# Altium schematic sheet I2Cbus.SchDoc
size A4
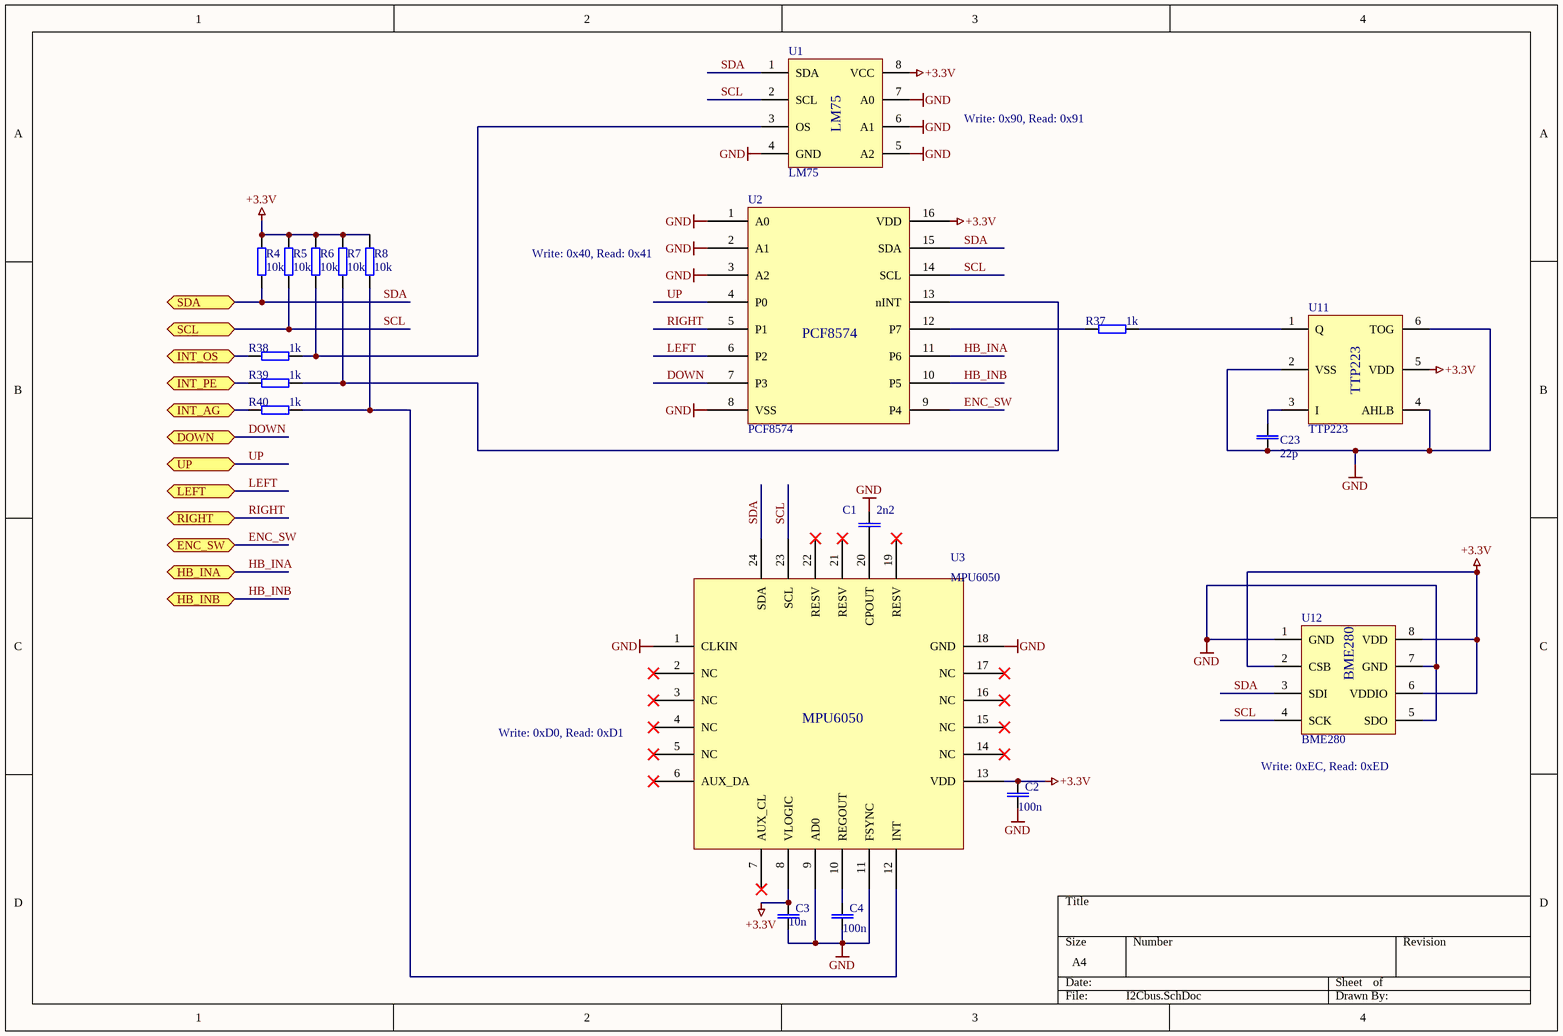
[diagram p0: I2Cbus.SchDoc]

## Parts
C1  2n2  [CAP 0805]
C2  100n  [CAP 0805]
C3  10n  [CAP 0805]
C4  100n  [CAP 0805]
C23  22p  [CAP 0805]
R4  10k  [RES 0805]
R5  10k  [RES 0805]
R6  10k  [RES 0805]
R7  10k  [RES 0805]
R8  10k  [RES 0805]
R37  1k  [RES 0805]
R38  1k  [RES 0805]
R39  1k  [RES 0805]
R40  1k  [RES 0805]
U1  LM75  [SO8]
U2  PCF8574  [SO16W]
U3  MPU6050  [QFN24]
U11  TTP223  [SOT-23-6L]
U12  BME280  [BME280]

## Ports
DOWN (bidir), ENC_SW (bidir), HB_INA (bidir), HB_INB (bidir), INT_AG (bidir), INT_OS (bidir), INT_PE (bidir), LEFT (bidir), RIGHT (bidir), SCL (bidir), SDA (bidir), UP (bidir)

## Nets
+3.3V: C2.1 C3.1 R4.2 R5.2 R6.2 R7.2 R8.2 U1.8(VCC) U2.16(VDD) U3.8(VLOGIC) U3.13(VDD) U11.5(VDD) U12.2(CSB) U12.6(VDDIO) U12.8(VDD)
GND: C1.2 C2.2 C3.2 C4.2 C23.2 U1.4(GND) U1.5(A2) U1.6(A1) U1.7(A0) U2.1(A0) U2.2(A1) U2.3(A2) U2.8(VSS) U3.1(CLKIN) U3.9(AD0) U3.11(FSYNC) U3.18(GND) U11.2(VSS) U11.4(AHLB) U11.6(TOG) U12.1(GND) U12.5(SDO) U12.7(GND)
DOWN: U2.7(P3) ; port DOWN
ENC_SW: U2.9(P4) ; port ENC_SW
HB_INA: U2.11(P6) ; port HB_INA
HB_INB: U2.10(P5) ; port HB_INB
INT_AG: R40.1 ; port INT_AG
INT_OS: R38.1 ; port INT_OS
INT_PE: R39.1 ; port INT_PE
LEFT: U2.6(P2) ; port LEFT
RIGHT: U2.5(P1) ; port RIGHT
SCL: R5.1 U1.2(SCL) U2.14(SCL) U3.23(SCL) U12.4(SCK) ; port SCL
SDA: R4.1 U1.1(SDA) U2.15(SDA) U3.24(SDA) U12.3(SDI) ; port SDA
UP: U2.4(P0) ; port UP
NetC1_1: C1.1 U3.20(CPOUT)
NetC4_1: C4.1 U3.10(REGOUT)
NetC23_1: C23.1 U11.3(I)
NetR6_1: R6.1 R38.2 U1.3(OS)
NetR7_1: R7.1 R39.2 U2.13(nINT)
NetR8_1: R8.1 R40.2 U3.12(INT)
NetR37_1: R37.1 U2.12(P7)
NetR37_2: R37.2 U11.1(Q)

Not connected (* = marked no-connect by the designer): U3 2(NC)* 3(NC)* 4(NC)* 5(NC)* 6(AUX_DA)* 7(AUX_CL)* 14(NC)* 15(NC)* 16(NC)* 17(NC)* 19(RESV)* 21(RESV)* 22(RESV)*

## Notes on the sheet
- Write: 0x90, Read: 0x91
- Write: 0x40, Read: 0x41
- Write: 0xD0, Read: 0xD1
- (near U12) Write: 0xEC, Read: 0xED

## Library data of the parts
C1-C4 C23 = CAP: NON POLARIZED CAPACITOR; Reference: 82-01-25; Supplier: LOMEX
  C1: VALUE: 2n2
  C2 C4: VALUE: 100n
  C3: VALUE: 10n
  C23: VALUE: 22p
R4-R8 R37-R40 = RES: RESISTOR
  R4-R8: REFERENCE ID: *; DISTRIBUTOR: *; VALUE: 10k
  R37-R40: Reference: 81-10-99; Supplier: LOMEX; VALUE: 1k
U1 = LM75: Temperature sensor with I2C interface; Name: LM75; Datasheet: https://datasheets.maximintegrated.com/en/ds/LM75.pdf
U2 = PCF8574: I/O expander I2C bus; Datasheet: http://www.ti.com/lit/ds/symlink/pcf8574.pdf; Name: PCF8574
U3 = MPU6050: 6 axis gyroscope and accelerometer sensor; Name: MPU6050; Datasheet: https://store.invensense.com/datasheets/invensense/MPU-6050_DataSheet_V3%204.pdf
U11 = TTP223: 1 KEY TOUCH PAD DETECTOR IC; Name: TTP223; Datasheet: https://datasheet.lcsc.com/szlcsc/TTP223-BA6_C80757.pdf
U12 = BME280: BME280 Environmental sensor; Name: BME280; Datasheet: https://www.embeddedadventures.com/datasheets/BME280.pdf